# EAGLE schematic DS1307_SMD_0603 (EAGLE 7.5.0)
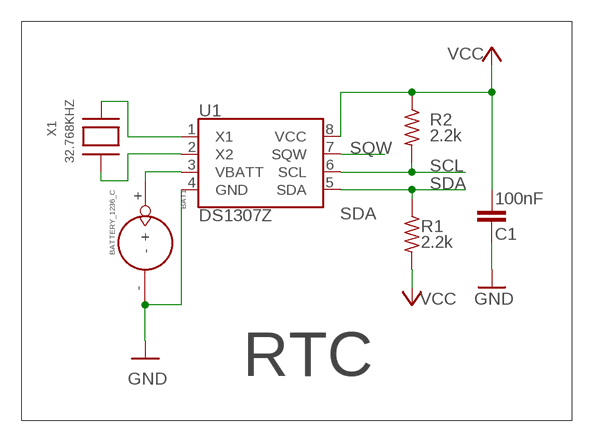
[diagram p0: schematic, sheet 1]

## Parts
BAT1  BATTERY_1236_C  [BATTERY_1236_C]
C1  100nF  C-EUC0603  [C0603]
R1  2.2k  R-US_R0603  [R0603]
R2  2.2k  R-US_R0603  [R0603]
U1  DS1307Z  [SO08-0.15]
X1  32.768KHZ  XTAL-3.2X1.5  [XTAL3215]

## Nets
GND: BAT1.- C1.1 U1.4(GND)
N$1: U1.1(X1) X1.P$2
N$2: U1.2(X2) X1.P$1
N$4: BAT1.+ U1.3(VBATT)
SCL: R2.2 U1.6(SCL)
SDA: R1.1 U1.5(SDA)
SQW: U1.7(SQW)
VCC: C1.2 R1.2 R2.1 U1.8(VCC)

## Notes on the sheet
- RTC

## Library data of the parts
BAT1 = Itead_BP_110825.lbr:BATTERY_1236_C: SOC004
C1 = rcl:C-EU: CAPACITOR, European symbol; SPICEPREFIX: C
R1 R2 = adafruit:R-US_: RESISTOR, American symbol
U1 = SparkFun-Clocks:DS1307: Maxim DS1307 - I2C Real-time clock (RTC) The DS1307 serial real-time clock (RTC) is a low-power, full binary-coded decimal (BCD) clock/calendar plus 56 bytes of NV SRAM. Address and data are transferred serially through an I2C, bidirectional bus. The clock/calendar provides seconds, minutes, hours, day, date, month, and year information. SparkFun Products: Real Time Clock Module <https://www.sparkfun.com/products/12708> (BOB-12708) Datasheet <https://cdn.sparkfun.com/datasheets/BreakoutBoards/DS1307.pdf>; PROD_ID: IC-08138
X1 = adafruit:XTAL: Low cost SMT crystals, no capacitors included http://www.ladyada.net/library/eagle